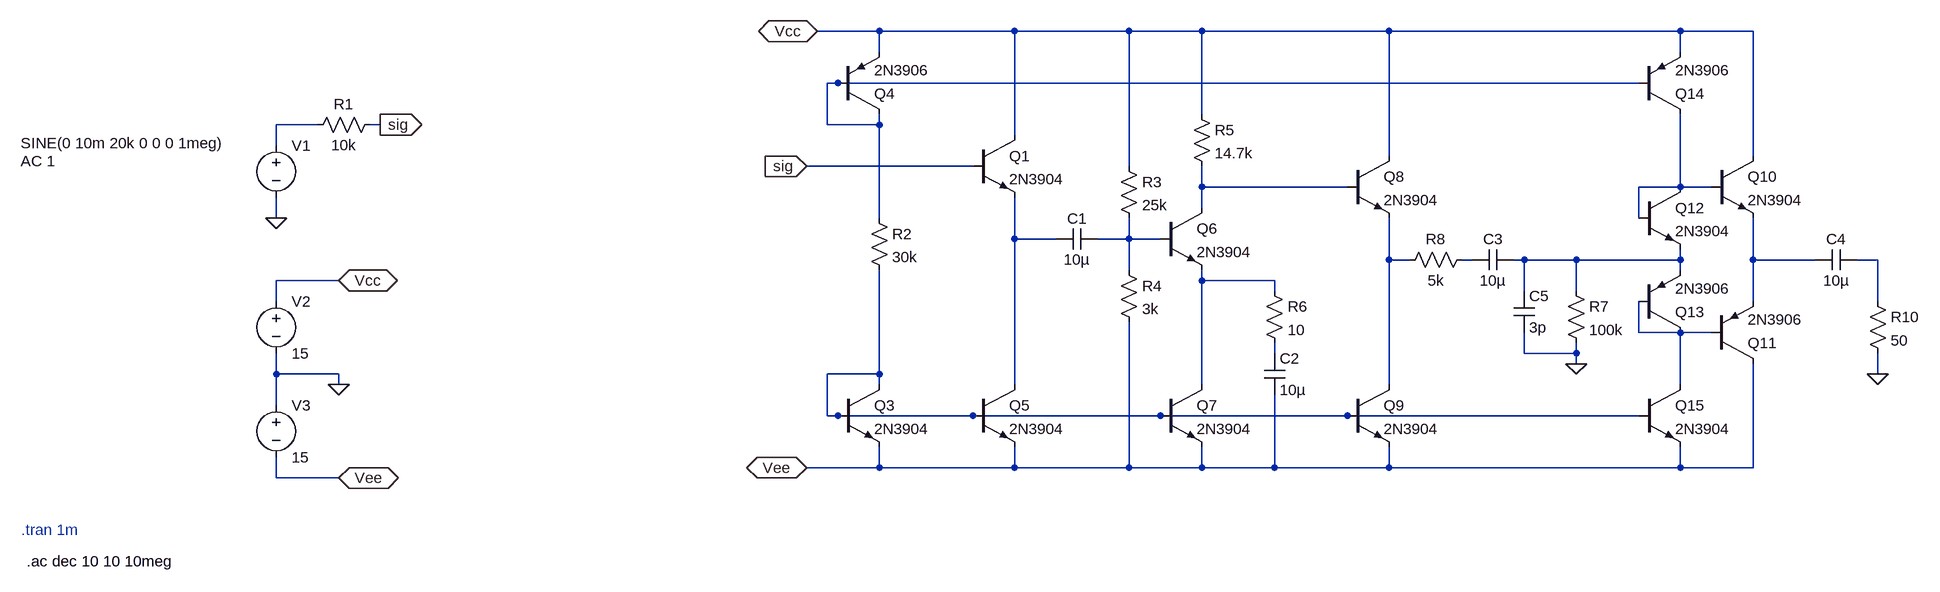
[diagram p0: schematic bjt_amplifier.asc]
bjt_amplifier.asc, the LTspice schematic file:
Version 4
SHEET 1 1876 680
WIRE 272 -208 176 -208
WIRE 480 -208 272 -208
WIRE 656 -208 480 -208
WIRE 768 -208 656 -208
WIRE 1056 -208 768 -208
WIRE 1504 -208 1056 -208
WIRE 1616 -208 1504 -208
WIRE 272 -176 272 -208
WIRE 1504 -176 1504 -208
WIRE 208 -128 192 -128
WIRE 1440 -128 208 -128
WIRE 768 -80 768 -208
WIRE -592 -64 -656 -64
WIRE -496 -64 -512 -64
WIRE 192 -64 192 -128
WIRE 272 -64 272 -80
WIRE 272 -64 192 -64
WIRE 480 -48 480 -208
WIRE -656 -32 -656 -64
WIRE 1056 -16 1056 -208
WIRE 1616 -16 1616 -208
WIRE 416 0 160 0
WIRE 656 0 656 -208
WIRE 768 32 768 0
WIRE 992 32 768 32
WIRE 1504 32 1504 -80
WIRE 1504 32 1440 32
WIRE 1552 32 1504 32
WIRE 768 64 768 32
WIRE -656 80 -656 48
WIRE 272 80 272 -64
WIRE 1440 80 1440 32
WIRE 480 112 480 48
WIRE 544 112 480 112
WIRE 656 112 656 80
WIRE 656 112 608 112
WIRE 704 112 656 112
WIRE 1056 144 1056 80
WIRE 1088 144 1056 144
WIRE 1184 144 1168 144
WIRE 1264 144 1248 144
WIRE 1344 144 1264 144
WIRE 1504 144 1504 128
WIRE 1504 144 1344 144
WIRE 1616 144 1616 80
WIRE 1712 144 1616 144
WIRE 1808 144 1776 144
WIRE 656 160 656 112
WIRE 1504 160 1504 144
WIRE -560 176 -656 176
WIRE 768 176 768 160
WIRE 880 176 768 176
WIRE 880 192 880 176
WIRE 1264 192 1264 144
WIRE 1344 192 1344 144
WIRE -656 208 -656 176
WIRE 1616 208 1616 144
WIRE 1808 208 1808 144
WIRE 1440 256 1440 208
WIRE 1504 256 1440 256
WIRE 1552 256 1504 256
WIRE 880 288 880 272
WIRE 1264 288 1264 256
WIRE 1344 288 1344 272
WIRE 1344 288 1264 288
WIRE 1344 304 1344 288
WIRE -656 320 -656 288
WIRE -560 320 -656 320
WIRE 272 320 272 160
WIRE 272 320 192 320
WIRE 1808 320 1808 288
WIRE -560 336 -560 320
WIRE 272 336 272 320
WIRE 480 336 480 112
WIRE 768 336 768 176
WIRE 1056 336 1056 144
WIRE 1504 336 1504 256
WIRE -656 368 -656 320
WIRE 192 384 192 320
WIRE 208 384 192 384
WIRE 416 384 208 384
WIRE 704 384 416 384
WIRE 992 384 704 384
WIRE 1440 384 992 384
WIRE 272 464 272 432
WIRE 272 464 160 464
WIRE 480 464 480 432
WIRE 480 464 272 464
WIRE 656 464 656 240
WIRE 656 464 480 464
WIRE 768 464 768 432
WIRE 768 464 656 464
WIRE 880 464 880 352
WIRE 880 464 768 464
WIRE 1056 464 1056 432
WIRE 1056 464 880 464
WIRE 1504 464 1504 432
WIRE 1504 464 1056 464
WIRE 1616 464 1616 304
WIRE 1616 464 1504 464
WIRE -656 480 -656 448
WIRE -560 480 -656 480
FLAG -656 80 0
FLAG -496 -64 sig
IOPIN -496 -64 Out
FLAG -560 336 0
FLAG -560 176 Vcc
IOPIN -560 176 BiDir
FLAG -560 480 Vee
IOPIN -560 480 BiDir
FLAG 160 0 sig
IOPIN 160 0 In
FLAG 176 -208 Vcc
IOPIN 176 -208 BiDir
FLAG 160 464 Vee
IOPIN 160 464 BiDir
FLAG 1344 304 0
FLAG 1808 320 0
SYMBOL npn 416 -48 R0
SYMATTR InstName Q1
SYMATTR Value 2N3904
SYMBOL voltage -656 -48 R0
WINDOW 3 -393 12 Left 2
WINDOW 123 -393 40 Left 2
WINDOW 39 0 0 Left 0
SYMATTR Value SINE(0 10m 20k 0 0 0 1meg)
SYMATTR Value2 AC 1
SYMATTR InstName V1
SYMBOL res -496 -80 R90
WINDOW 0 0 56 VBottom 2
WINDOW 3 32 56 VTop 2
SYMATTR InstName R1
SYMATTR Value 10k
SYMBOL npn 208 336 R0
SYMATTR InstName Q3
SYMATTR Value 2N3904
SYMBOL res 256 64 R0
SYMATTR InstName R2
SYMATTR Value 30k
SYMBOL pnp 208 -80 M180
SYMATTR InstName Q4
SYMATTR Value 2N3906
SYMBOL voltage -656 192 R0
WINDOW 123 0 0 Left 0
WINDOW 39 0 0 Left 0
SYMATTR InstName V2
SYMATTR Value 15
SYMBOL voltage -656 352 R0
WINDOW 123 0 0 Left 0
WINDOW 39 0 0 Left 0
SYMATTR InstName V3
SYMATTR Value 15
SYMBOL npn 416 336 R0
SYMATTR InstName Q5
SYMATTR Value 2N3904
SYMBOL npn 704 64 R0
SYMATTR InstName Q6
SYMATTR Value 2N3904
SYMBOL res 640 -16 R0
SYMATTR InstName R3
SYMATTR Value 25k
SYMBOL res 640 144 R0
SYMATTR InstName R4
SYMATTR Value 3k
SYMBOL npn 704 336 R0
SYMATTR InstName Q7
SYMATTR Value 2N3904
SYMBOL res 752 -96 R0
SYMATTR InstName R5
SYMATTR Value 14.7k
SYMBOL cap 608 96 R90
WINDOW 0 0 32 VBottom 2
WINDOW 3 32 32 VTop 2
SYMATTR InstName C1
SYMATTR Value 10µ
SYMBOL cap 864 288 R0
SYMATTR InstName C2
SYMATTR Value 10µ
SYMBOL res 864 176 R0
SYMATTR InstName R6
SYMATTR Value 10
SYMBOL npn 992 -16 R0
SYMATTR InstName Q8
SYMATTR Value 2N3904
SYMBOL npn 992 336 R0
SYMATTR InstName Q9
SYMATTR Value 2N3904
SYMBOL npn 1552 -16 R0
SYMATTR InstName Q10
SYMATTR Value 2N3904
SYMBOL npn 1440 32 R0
SYMATTR InstName Q12
SYMATTR Value 2N3904
SYMBOL pnp 1552 304 M180
SYMATTR InstName Q11
SYMATTR Value 2N3906
SYMBOL pnp 1440 256 M180
SYMATTR InstName Q13
SYMATTR Value 2N3906
SYMBOL pnp 1440 -80 M180
SYMATTR InstName Q14
SYMATTR Value 2N3906
SYMBOL npn 1440 336 R0
SYMATTR InstName Q15
SYMATTR Value 2N3904
SYMBOL cap 1248 128 R90
WINDOW 0 0 32 VBottom 2
WINDOW 3 32 32 VTop 2
SYMATTR InstName C3
SYMATTR Value 10µ
SYMBOL res 1184 128 R90
WINDOW 0 0 56 VBottom 2
WINDOW 3 32 56 VTop 2
SYMATTR InstName R8
SYMATTR Value 5k
SYMBOL res 1328 176 R0
SYMATTR InstName R7
SYMATTR Value 100k
SYMBOL cap 1776 128 R90
WINDOW 0 0 32 VBottom 2
WINDOW 3 32 32 VTop 2
SYMATTR InstName C4
SYMATTR Value 10µ
SYMBOL res 1792 192 R0
SYMATTR InstName R10
SYMATTR Value 50
SYMBOL cap 1248 192 R0
SYMATTR InstName C5
SYMATTR Value 3p
TEXT -1048 560 Left 2 ;.tran 1m
TEXT -1040 608 Left 2 !.ac dec 10 10 10meg

The netlist it stands for:
* bjt_amplifier.asc
Q1 Vcc sig N005 0 2N3904
V1 N002 0 SINE(0 10m 20k 0 0 0 1meg) AC 1
R1 sig N002 10k
Q3 N015 N015 Vee 0 2N3904
R2 N001 N015 30k
Q4 N001 N001 Vcc 0 2N3906
V2 Vcc 0 15
V3 0 Vee 15
Q5 N005 N015 Vee 0 2N3904
Q6 N003 N006 N012 0 2N3904
R3 Vcc N006 25k
R4 N006 Vee 3k
Q7 N012 N015 Vee 0 2N3904
R5 Vcc N003 14.7k
C1 N006 N005 10µ
C2 N014 Vee 10µ
R6 N012 N014 10
Q8 Vcc N003 N007 0 2N3904
Q9 N007 N015 Vee 0 2N3904
Q10 Vcc N004 N010 0 2N3904
Q12 N004 N004 N009 0 2N3904
Q11 Vee N013 N010 0 2N3906
Q13 N013 N013 N009 0 2N3906
Q14 N004 N001 Vcc 0 2N3906
Q15 N013 N015 Vee 0 2N3904
C3 N009 N008 10µ
R8 N008 N007 5k
R7 N009 0 100k
C4 N011 N010 10µ
R10 N011 0 50
C5 N009 0 3p
.model NPN NPN
.model PNP PNP
.lib standard.bjt
* .tran 1m
.ac dec 10 10 10meg
.backanno
.end